# EAGLE schematic Vers. 2 Moppy Board (EAGLE 9.1.3)
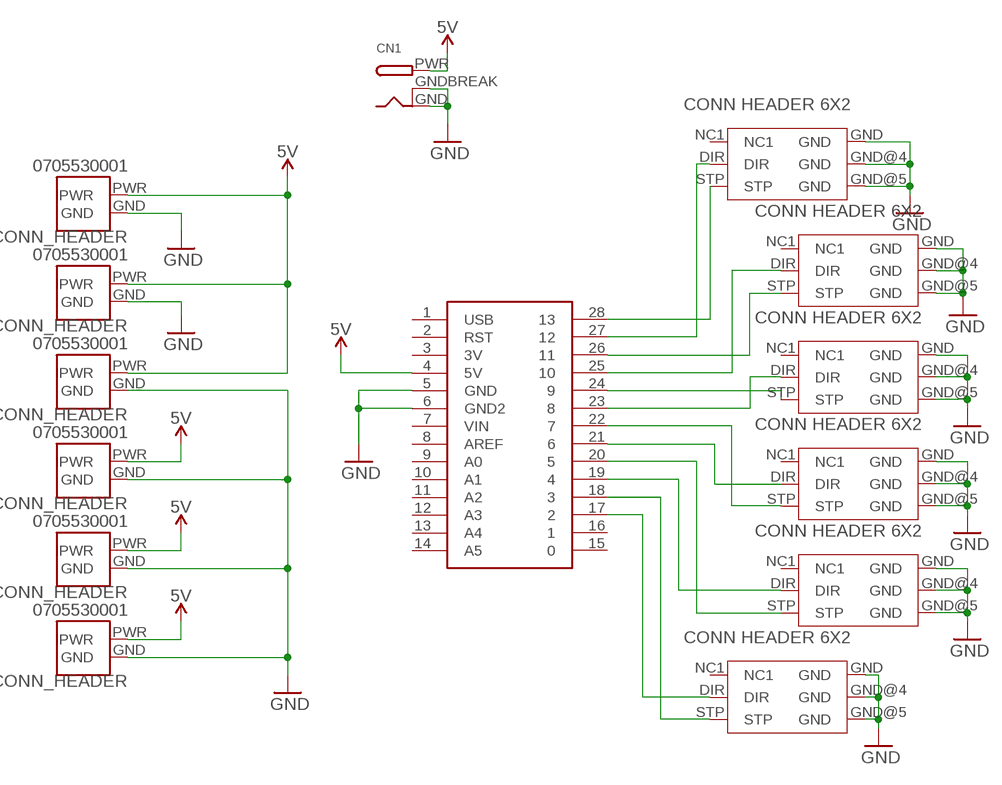
[diagram p0: schematic, sheet 1]

## Parts
CN1  DCBARRELPTH  [DCJACK_2MM_PTH]
U$1  6X2_CONN-HEADER-2.54MM  [6X2_CONN_HEADER_2.54MM]
U$2  6X2_CONN-HEADER-2.54MM  [6X2_CONN_HEADER_2.54MM]
U$3  6X2_CONN-HEADER-2.54MM  [6X2_CONN_HEADER_2.54MM]
U$4  6X2_CONN-HEADER-2.54MM  [6X2_CONN_HEADER_2.54MM]
U$5  6X2_CONN-HEADER-2.54MM  [6X2_CONN_HEADER_2.54MM]
U$6  6X2_CONN-HEADER-2.54MM  [6X2_CONN_HEADER_2.54MM]
U$8  METROMINI  [METROMINI]
X1  0705530001  [MOLEX_0705530001]
X2  0705530001  [MOLEX_0705530001]
X3  0705530001  [MOLEX_0705530001]
X4  0705530001  [MOLEX_0705530001]
X5  0705530001  [MOLEX_0705530001]
X6  0705530001  [MOLEX_0705530001]

## Nets
5V: CN1.PWR U$8.4(5V) X1.PWR X2.PWR X3.PWR X4.PWR X5.PWR X6.PWR
GND: CN1.GND CN1.GNDBREAK U$1.GND U$1.GND@4(GND) U$1.GND@5(GND) U$2.GND U$2.GND@4(GND) U$2.GND@5(GND) U$3.GND U$3.GND@4(GND) U$3.GND@5(GND) U$4.GND U$4.GND@4(GND) U$4.GND@5(GND) U$5.GND U$5.GND@4(GND) U$5.GND@5(GND) U$6.GND U$6.GND@4(GND) U$6.GND@5(GND) U$8.5(GND) U$8.6(GND2) X1.GND X2.GND X3.GND X4.GND X5.GND X6.GND
N$1: U$6.STP U$8.18
N$2: U$3.STP U$8.24
N$3: U$5.DIR U$8.19
N$4: U$5.STP U$8.20
N$5: U$4.STP U$8.22
N$6: U$4.DIR U$8.21
N$7: U$3.DIR U$8.23
N$8: U$2.STP U$8.26
N$9: U$2.DIR U$8.25
N$10: U$1.STP U$8.28
N$11: U$1.DIR U$8.27
N$13: U$6.DIR U$8.17
Unconnected: U$1.NC1 U$2.NC1 U$3.NC1 U$4.NC1 U$5.NC1 U$6.NC1 U$8.1(USB) U$8.2(RST) U$8.3(3V) U$8.7(VIN) U$8.8(AREF) U$8.9(A0) U$8.10(A1) U$8.11(A2) U$8.12(A3) U$8.13(A4) U$8.14(A5) U$8.15 U$8.16

## Library data of the parts
CN1 = adafruit:DCBARREL: 2.0mm DC Barrel Jack DCJACK_2MM_PTH - Through Hole Jack (4UConnector: 05537)
U$1-U$6 = Danielle's Library:6X2_CONN-HEADER-2.54MM
U$8 = MetroMINI:METROMINI
X1-X6 = 2.54_CONN_HEADER:0705530001: Conn Shrouded Header HDR 2 POS 2.54mm Solder RA Thru-Hole SLÃ¢âÂ¢ Tube; DESCRIPTION: Conn Shrouded Header HDR 2 POS 2.54mm Solder RA Thru-Hole SLÃ¢âÂ¢ Tube; DIGI-KEY_PART_NUMBER: WM4900-ND; DIGI-KEY_PURCHASE_URL: https://www.digikey.com/product-detail/en/molex/0705530001/WM4900-ND/114951?utm_source=snapeda&utm_medium=aggregator&utm_campaign=symbol; MF: Molex; MP: 0705530001; PACKAGE: None